# EAGLE design TiltMouseThroughHole (EAGLE 6.5.0)
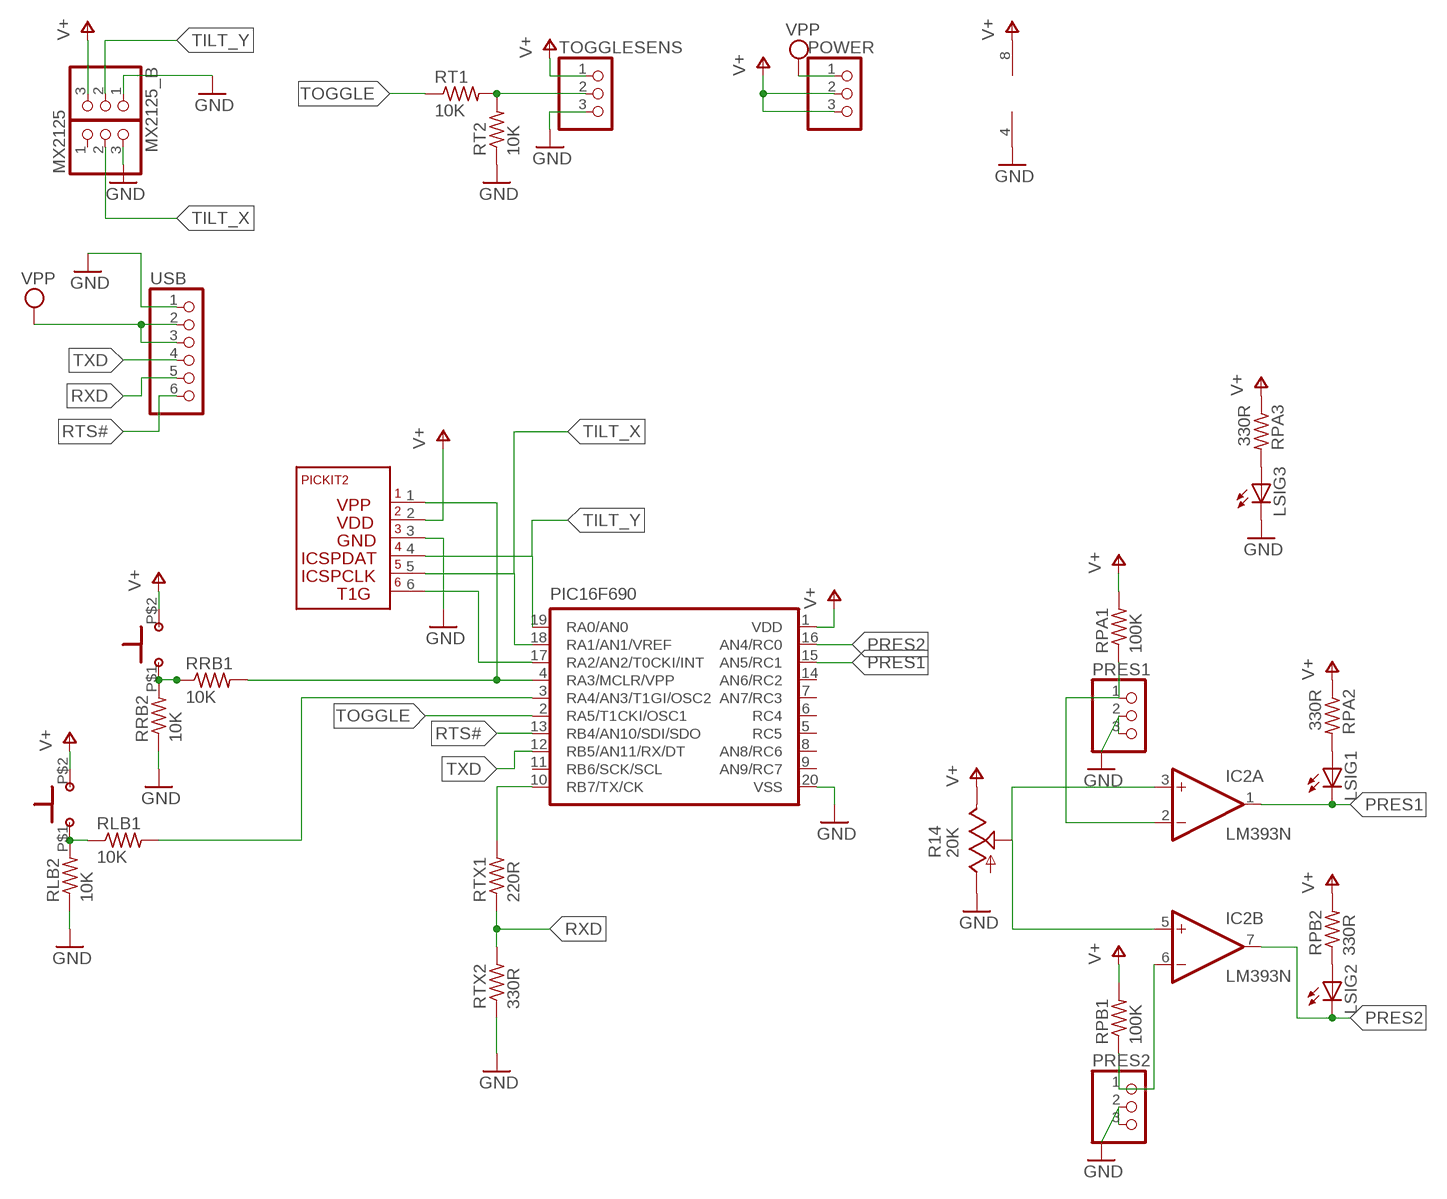
[diagram p0: schematic, sheet 1]

## Parts
IC2  LM393N  [DIL08]
LB  PUSHBUTTON  [PUSHBUTTON]
LSIG1  LED5MM  [LED5MM]
LSIG2  LED5MM  [LED5MM]
LSIG3  LED5MM  [LED5MM]
MX2125  PINHD-1X3  [1X03]
MX2125_B  PINHD-1X3  [1X03]
PIC16F690  PIC16F6XX  [DIL20]
POWER  PINHD-1X3  [1X03]
PRES1  PINHD-1X3/90  [1X03/90]
PRES2  PINHD-1X3/90  [1X03/90]
R14  20K  TRIM_US-B25P  [B25P]
RB  PUSHBUTTON  [PUSHBUTTON]
RLB1  10K  R-US_0207/12  [0207/12]
RLB2  10K  R-US_0207/12  [0207/12]
RPA1  100K  R-US_0207/10  [0207/10]
RPA2  330R  R-US_0207/15  [0207/15]
RPA3  330R  R-US_0207/10  [0207/10]
RPB1  100K  R-US_0207/10  [0207/10]
RPB2  330R  R-US_0207/15  [0207/15]
RRB1  10K  R-US_0207/12  [0207/12]
RRB2  10K  R-US_0207/12  [0207/12]
RT1  10K  R-US_0207/10  [0207/10]
RT2  10K  R-US_0207/10  [0207/10]
RTX1  220R  R-US_0207/15  [0207/15]
RTX2  330R  R-US_0207/15  [0207/15]
TOGGLESENS  PINHD-1X3  [1X03]
U$1  PICKIT-ICSP  [PICKITJUMPER]
USB  PINHD-1X6/90  [1X06/90]

## Nets
GND: IC2.4(P:V-) LSIG3.K(C) MX2125.3 MX2125_B.1 PIC16F690.20(VSS) PRES1.2 PRES1.3 PRES2.2 PRES2.3 R14.A RLB2.1 RRB2.1 RT2.1 RTX2.1 TOGGLESENS.3 U$1.3 USB.1
N$1: PIC16F690.4(RA3/MCLR/VPP) RRB1.2 U$1.1
N$2: RT1.2 RT2.2 TOGGLESENS.2
N$3: IC2.2(A:-IN) PRES1.1 RPA1.1
N$4: PIC16F690.17(RA2/AN2/T0CKI/INT) U$1.6
N$5: PIC16F690.10(RB7/TX/CK) RTX1.2
N$6: RB.P$1 RRB1.1 RRB2.2
N$7: LB.P$1 RLB1.1 RLB2.2
N$8: PIC16F690.3(RA4/AN3/T1GI/OSC2) RLB1.2
N$9: IC2.6(B:-IN) PRES2.1 RPB1.1
N$10: IC2.3(A:+IN) IC2.5(B:+IN) R14.S
N$11: LSIG2.A RPB2.1
N$12: LSIG1.A RPA2.2
N$13: LSIG3.A RPA3.2
PRES1: IC2.1(A:OUT) LSIG1.K(C) PIC16F690.15(AN5/RC1)
PRES2: IC2.7(B:OUT) LSIG2.K(C) PIC16F690.16(AN4/RC0)
RTS#: PIC16F690.13(RB4/AN10/SDI/SDO) USB.6
RXD: RTX1.1 RTX2.2 USB.5
TILT_X: MX2125.2 PIC16F690.18(RA1/AN1/VREF) U$1.5
TILT_Y: MX2125_B.2 PIC16F690.19(RA0/AN0) U$1.4
TOGGLE: PIC16F690.2(RA5/T1CKI/OSC1) RT1.1
TXD: PIC16F690.12(RB5/AN11/RX/DT) USB.4
V+: IC2.8(P:V+) LB.P$2 MX2125_B.3 PIC16F690.1(VDD) POWER.2 POWER.3 R14.E RB.P$2 RPA1.2 RPA2.1 RPA3.1 RPB1.2 RPB2.2 TOGGLESENS.1 U$1.2
VPP: POWER.1 USB.2 USB.3
Unconnected: MX2125.1 PIC16F690.5(RC5) PIC16F690.6(RC4) PIC16F690.7(AN7/RC3) PIC16F690.8(AN8/RC6) PIC16F690.9(AN9/RC7) PIC16F690.11(RB6/SCK/SCL) PIC16F690.14(AN6/RC2)

## Library data of the parts
IC2 = linear:LM393: COMPARATOR
LB RB = TEJ4M1:PUSHBUTTON
LSIG1-LSIG3 = led:LED: LED OSRAM: - CHIPLED LG R971, LG N971, LY N971, LG Q971, LY Q971, LO R971, LY R971 LH N974, LH R974 LS Q976, LO Q976, LY Q976 LO Q996 - Hyper CHIPLED LW Q18S LB Q993, LB Q99A, LB R99A - SideLED LS A670, LO A670, LY A670, LG A670, LP A670 LB A673, LV A673, LT A673, LW A673 LH A674 LY A675 LS A676, LA A676, LO A676, LY A676, LW A676 LS A679, LY A679, LG A679 - Hyper Micro SIDELED® LS Y876, LA Y876, LO Y876, LY Y876 LT Y87S - SmartLED LW L88C, LW L88S LB L89C, LB L89S, LG L890 LS L89K, LO L89K, LY L89K LS L896, LA L896, LO L896, LY L896 - TOPLED LS T670, LO T670, LY T670, LG T670, LP T670 LSG T670, LSP T670, LSY T670, LOP T670, LYG T670 LG T671, LOG T671, LSG T671 LB T673, LV T673, LT T673, LW T673 LH T674 LS T676, LA T676, LO T676, LY T676, LB T676, LH T676, LSB T676, LW T676 LB T67C, LV T67C, LT T67C, LS T67K, LO T67K, LY T67K, LW E67C LS E67B, LA E67B, LO E67B, LY E67B, LB E67C, LV E67C, LT E67C LW T67C LS T679, LY T679, LG T679 LS T770, LO T770, LY T770, LG T770, LP T770 LB T773, LV T773, LT T773, LW T773 LH T774 LS E675, LA E675, LY E675, LS T675 LS T776, LA T776, LO T776, LY T776, LB T776 LHGB T686 LT T68C, LB T68C - Hyper Mini TOPLED® LB M676 - Mini TOPLED Santana® LG M470 LS M47K, LO M47K, LY M47K Source: http://www.osram.convergy.de LUXEON: - LUMILED® LXK2-PW12-R00, LXK2-PW12-S00, LXK2-PW14-U00, LXK2-PW14-V00 LXK2-PM12-R00, LXK2-PM12-S00, LXK2-PM14-U00 LXK2-PE12-Q00, LXK2-PE12-R00, LXK2-PE12-S00, LXK2-PE14-T00, LXK2-PE14-U00 LXK2-PB12-K00, LXK2-PB12-L00, LXK2-PB12-M00, LXK2-PB14-N00, LXK2-PB14-P00, LXK2-PB14-Q00 LXK2-PR12-L00, LXK2-PR12-M00, LXK2-PR14-Q00, LXK2-PR14-R00 LXK2-PD12-Q00, LXK2-PD12-R00, LXK2-PD12-S00 LXK2-PH12-R00, LXK2-PH12-S00 LXK2-PL12-P00, LXK2-PL12-Q00, LXK2-PL12-R00 Source: www.luxeon.com KINGBRIGHT: KA-3528ASYC Source: www.kingbright.com
MX2125 MX2125_B POWER PRES1 PRES2 TOGGLESENS = pinhead:PINHD-1X3: PIN HEADER
PIC16F690 = pic16f690:PIC16F6XX
R14 = pot:TRIM_US-: POTENTIOMETER
RLB1 RLB2 RPA1-RPA3 RPB1 RPB2 RRB1 RRB2 RT1 RT2 RTX1 RTX2 = resistor:R-US_: RESISTOR, American symbol
U$1 = TEJ4M1:PICKIT-ICSP: The Jumper for connecting in a PICKIT 2
USB = pinhead:PINHD-1X6: PIN HEADER

## Board
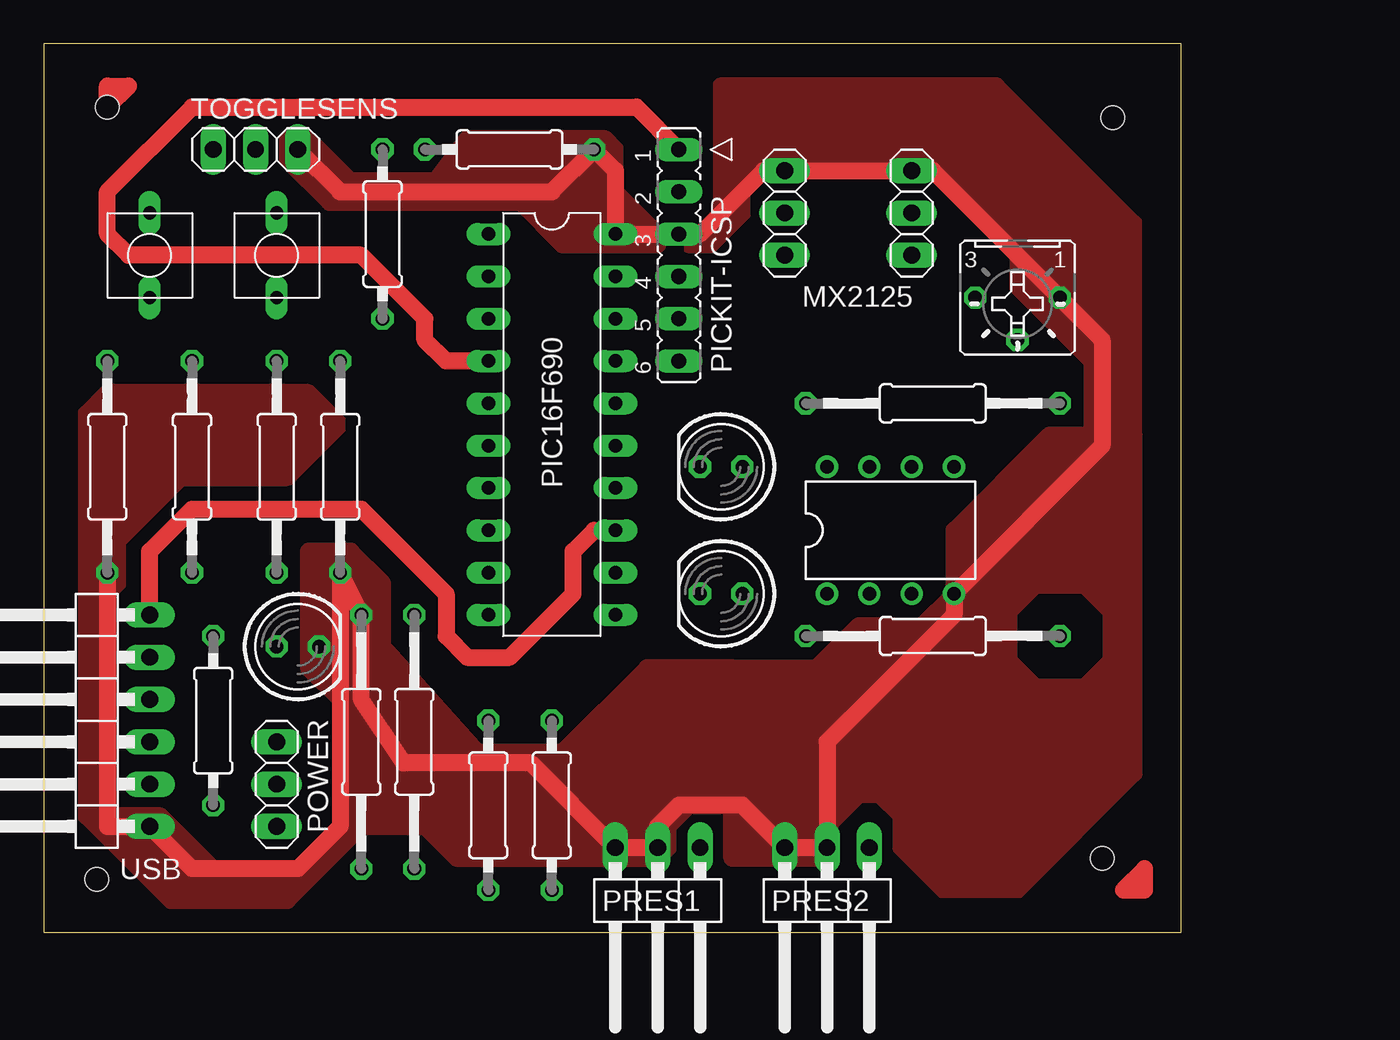
[diagram p1: board, top side]
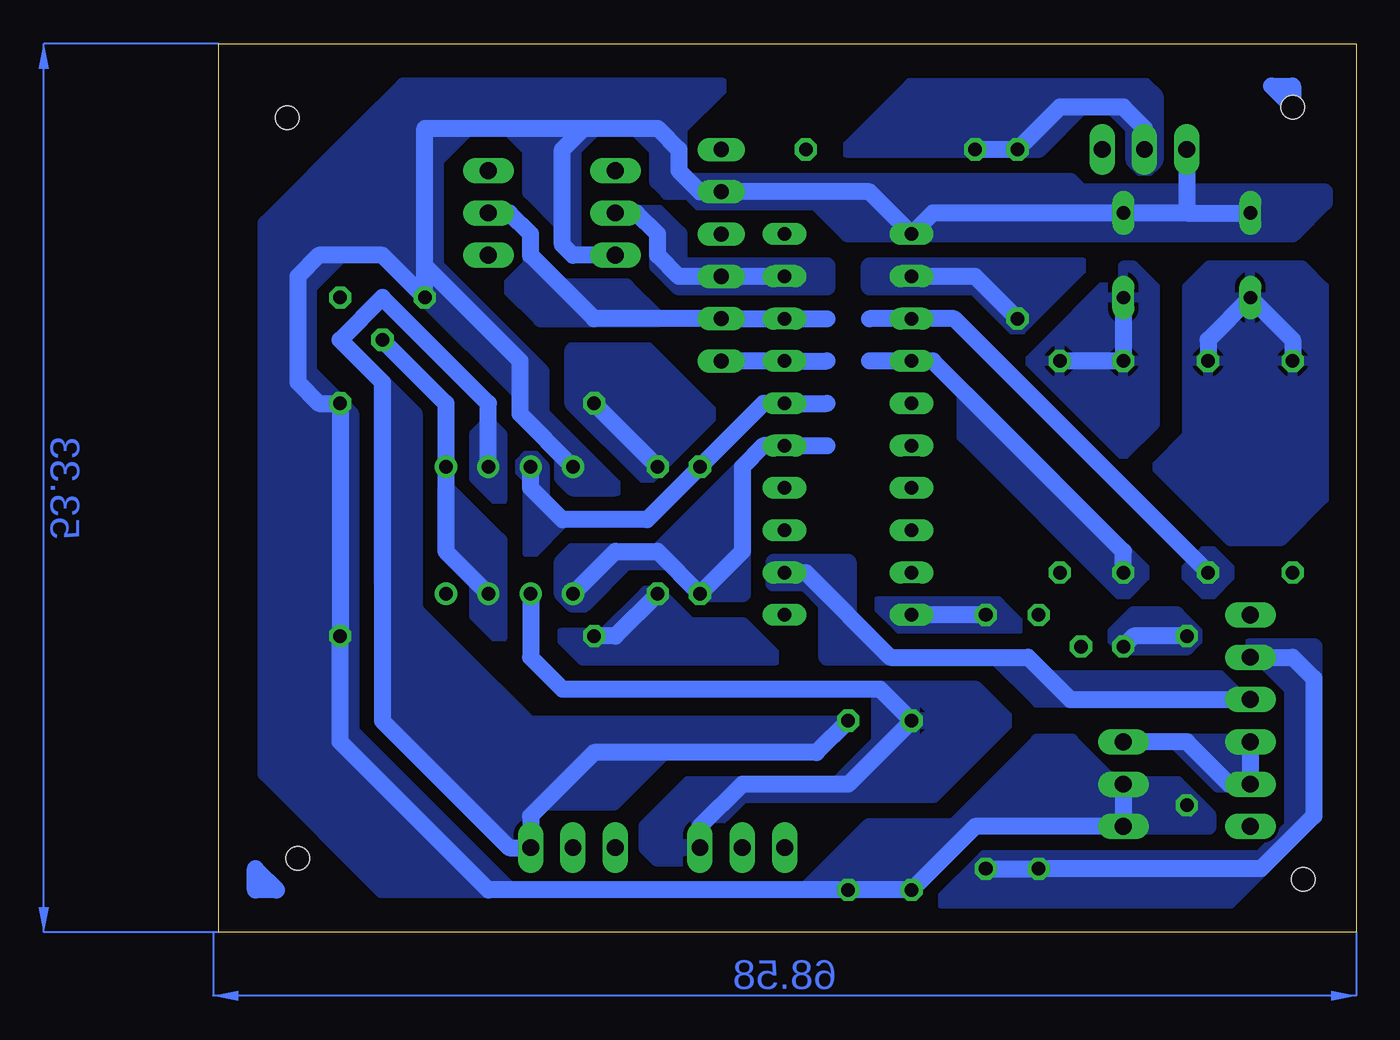
[diagram p2: board, bottom side, seen from below]

Size 68.25 x 53.33 mm. Coordinates in mm from the lower left corner, seen from the top.
Outline: 0,0 68.25,0 68.25,53.33 0,53.33 0,0
Copper layers (1*16): Top 0.035mm / dielectric 1.5mm / Bottom 0.035mm
Design rules "default *": minimum track width 40mil, minimum drill 24mil, track to track 8mil, track to pad 8mil, pad to pad 8mil, via to via 8mil, smd to smd 8mil, copper to edge 40mil, drill to drill 8mil, minimum pad ring 10mil, minimum via ring 8mil, stop-mask expansion 4mil, vias tented up to drill 0mil, thermal gap 10mil
Holes 1.4 mm at 63.5,4.45 64.14,48.9 3.81,49.53 3.17,3.17

### Footprints (pad centres in the part's own frame; a part is rotated, then mirrored left to right if it is on the bottom)
DIL08 = drill 0.813 pad 1.27: 1 -3.81,-3.81; 2 -1.27,-3.81; 3 1.27,-3.81; 4 3.81,-3.81; 5 3.81,3.81; 6 1.27,3.81; 7 -1.27,3.81; 8 -3.81,3.81
PUSHBUTTON = drill 0.8 long: P$1 -2.54,0; P$2 2.54,0
LED5MM = drill 0.813 octagon: A -1.27,0; K 1.27,0
1X03 = drill 1.016 long: 1 -2.54,0; 2 0,0; 3 2.54,0
DIL20 = drill 0.813 long: 1 -11.43,-3.81; 2 -8.89,-3.81; 3 -6.35,-3.81; 4 -3.81,-3.81; 5 -1.27,-3.81; 6 1.27,-3.81; 7 3.81,-3.81; 8 6.35,-3.81; 9 8.89,-3.81; 10 11.43,-3.81; 11 11.43,3.81; 12 8.89,3.81; 13 6.35,3.81; 14 3.81,3.81; 15 1.27,3.81; 16 -1.27,3.81; 17 -3.81,3.81; 18 -6.35,3.81; 19 -8.89,3.81; 20 -11.43,3.81
1X03/90 = drill 1.016 long: 1 -2.54,-3.81; 2 0,-3.81; 3 2.54,-3.81
B25P = drill 0.813 octagon: A -2.54,0; E 2.54,0; S 0,2.54
0207/12 = drill 0.813 octagon: 1 -6.35,0; 2 6.35,0
0207/10 = drill 0.813 octagon: 1 -5.08,0; 2 5.08,0
0207/15 = drill 0.813 octagon: 1 -7.62,0; 2 7.62,0
PICKITJUMPER = drill 0.914 long: 1 6.35,3.81; 2 3.81,3.81; 3 1.27,3.81; 4 -1.27,3.81; 5 -3.81,3.81; 6 -6.35,3.81
1X06/90 = drill 1.016 long: 1 -6.35,-3.81; 2 -3.81,-3.81; 3 -1.27,-3.81; 4 1.27,-3.81; 5 3.81,-3.81; 6 6.35,-3.81

### Placement (x,y rotation side)
IC2  50.8,24.13 0 top
LB  6.35,40.64 90 top
LSIG1  40.64,20.32 180 top
LSIG2  40.64,27.94 180 top
LSIG3  15.24,17.14 0 top
MX2125  52.07,43.18 90 top
MX2125_B  44.45,43.18 270 top
PIC16F690  30.48,30.48 270 top
POWER  13.97,8.89 270 top
PRES1  36.83,1.27 180 top
PRES2  46.99,1.27 180 top
R14  58.42,38.1 180 top
RB  13.97,40.64 90 top
RLB1  8.89,27.94 270 top
RLB2  3.81,27.94 90 top
RPA1  26.67,7.62 270 top
RPA2  53.34,17.78 180 top
RPA3  10.16,12.7 90 top
RPB1  30.48,7.62 270 top
RPB2  53.34,31.75 0 top
RRB1  13.97,27.94 270 top
RRB2  17.78,27.94 90 top
RT1  20.32,41.91 90 top
RT2  27.94,46.99 180 top
RTX1  22.23,11.43 90 top
RTX2  19.05,11.43 270 top
TOGGLESENS  12.7,46.99 0 top
U$1  41.91,40.64 90 top
USB  2.54,12.7 90 top

### Tracks (layer width: path | path; a pad name or v marks a point on that pad's centre or on a via)
GND
  Top 1.016: RLB2.1 3.81,6.35 USB.1 8.89,3.81 15.24,3.81 17.78,6.35 RRB2.1 RTX2.1 19.05,13.97 21.59,10.16 29.21,10.16 PRES1.3 PRES1.2 36.83,6.35 38.1,7.62 41.91,7.62 PRES2.3 PRES2.2 46.99,11.43 54.61,19.05 IC2.4 63.5,29.21 63.5,35.56 R14.A 53.34,45.72 MX2125.3 MX2125_B.1 43.18,45.72 39.37,41.91 U$1.3 PIC16F690.20 34.29,45.72 RT2.1 30.48,44.45 17.78,44.45 TOGGLESENS.3
  pour Top (no thermals): 36.83,41.91 34.29,44.45 34.29,46.99 33.66,47.62 25.4,47.62 23.5,45.09 18.41,45.09 15.88,47.62 14.61,47.62 14.61,46.35 17.14,43.81 28.57,43.81 31.11,41.27 36.83,41.27
  pour Top (no thermals): 38.73,41.27 40.01,41.27 41.91,43.18 41.91,44.45 43.18,45.72 53.34,45.72 58.42,40.64 58.42,38.73 62.87,34.29 62.87,29.21 65.41,29.21 65.41,42.55 57.15,50.8 40.64,50.8 40.64,43.18
  pour Top (no thermals): 65.41,29.84 65.41,9.53 58.42,2.54 53.98,2.54 51.44,5.08 51.44,6.99 50.16,8.26 48.9,8.26 46.99,6.35 46.99,4.45 41.27,4.45 41.27,15.88 46.35,15.88 48.9,18.41 52.7,18.41 54.61,20.32 54.61,24.13 60.33,29.84
  pour Top (no thermals): 41.27,15.88 36.2,15.88 31.11,10.79 26.04,10.79 20.32,17.14 20.32,20.95 18.41,22.86 15.88,22.86 15.88,15.88 17.78,13.97 17.78,6.35 15.24,3.81 10.16,3.81 6.99,6.99 2.54,6.99 7.62,1.91 14.61,1.91 19.05,6.35 22.86,6.35 24.77,4.45 36.83,4.45 37.47,5.08 37.47,6.35 38.73,7.62 41.27,7.62
  pour Top (no thermals): 3.81,20.32 4.45,20.95 4.45,23.5 8.26,27.3 14.61,27.3 17.78,30.48 15.88,32.38 3.81,32.38 2.54,31.11 2.54,6.99 3.81,6.99
  cutout Top: 59.69,20.32 58.42,19.05 58.42,16.51 59.69,15.24 62.23,15.24 63.5,16.51 63.5,19.05 62.23,20.32
N$1
  Top 1.016: PIC16F690.4 24.13,34.29 22.86,35.56 22.86,36.83 19.05,40.64 5.08,40.64 3.81,41.91 3.81,44.45 8.89,49.53 35.56,49.53 U$1.1
  Bottom 1.016: RRB1.2 13.97,22.86 25.4,34.29 PIC16F690.4 29.21,34.29
  pour Bottom (no thermals): 23.5,32.38 23.5,29.84 13.97,20.32 12.7,21.59
N$2
  Bottom 1.016: TOGGLESENS.2 12.7,48.26 13.97,49.53 17.78,49.53 RT1.2 RT2.2
  pour Bottom (no thermals): 30.48,46.99 26.67,50.8 12.7,50.8 12.06,50.16 12.06,46.35 12.7,45.72 13.34,46.35 13.34,48.26 14.61,49.53 16.51,49.53 19.05,46.99
N$3
  Bottom 1.016: PRES1.1 39.37,6.35 36.83,8.89 30.48,8.89 RPA1.1 28.57,14.61 47.62,14.61 49.53,16.51 IC2.2
  pour Bottom: 28.57,14.61 22.86,14.61 20.95,12.7 25.4,8.26 36.83,8.26 39.37,5.71 39.37,4.45 41.91,4.45 42.55,5.08 42.55,6.35 40.01,8.89 31.11,8.89 28.57,11.43
N$4
  Bottom 1.016: U$1.6 PIC16F690.17 31.75,34.29
N$5
  Bottom 1.016: RTX1.2 PIC16F690.10
  pour Bottom (no thermals): 20.32,18.41 27.3,18.41 28.57,19.68 21.59,19.68
N$6
  Bottom 1.016: RB.P$1 RRB1.1 RRB2.2
  pour Bottom: 13.34,40.01 13.97,40.01 19.68,34.29 13.97,28.57 12.06,30.48 12.06,38.73
N$7
  Bottom 1.016: RLB1.1 8.89,35.56 LB.P$1 3.81,35.56 RLB2.2
  pour Bottom: 3.17,40.01 8.89,40.01 10.16,38.73 10.16,29.84 12.06,27.94 7.62,23.5 4.45,23.5 1.91,26.04 1.91,38.73
N$8
  Bottom 1.016: RLB1.2 24.13,36.83 PIC16F690.3 29.21,36.83
  pour Bottom (no thermals): 8.89,22.86 10.16,21.59 8.89,20.32 7.62,21.59
N$9
  Bottom 1.016: RPB1.1 32.38,10.79 45.72,10.79 49.53,6.99 PRES2.1 50.8,5.08 58.42,12.7 58.42,33.02 60.96,35.56 58.42,38.1 52.07,31.75 IC2.6
  pour Bottom: 30.48,12.7 49.53,12.7 58.42,21.59 58.42,12.7 50.8,5.08 49.53,5.08 49.53,6.99 48.9,7.62 44.45,7.62 41.27,10.79 32.38,10.79
  pour Bottom (no thermals): 58.42,33.02 56.52,31.11 56.52,19.05 58.42,20.95
  pour Bottom (no thermals): 52.07,30.48 51.44,29.84 51.44,26.04 52.7,27.3 52.7,29.84
N$10
  Bottom 1.016: R14.S 54.61,31.75 IC2.5 54.61,22.86 IC2.3
  pour Bottom (no thermals): 54.61,26.67 51.44,23.5 51.44,17.78 52.7,19.05 52.7,20.95 54.61,22.86
N$11
  Bottom 1.016: RPB2.1 LSIG2.A
  pour Bottom (no thermals): 38.73,31.11 42.55,27.3 46.99,31.75 46.99,34.92 42.55,34.92
N$12
  Bottom 1.016: LSIG1.A 44.45,17.78 RPA2.2
  pour Bottom (no thermals): 47.62,17.78 45.09,17.78 42.55,20.32 41.91,20.32 40.01,18.41 36.83,18.41 34.92,16.51 46.35,16.51
N$13
  Bottom 1.016: RPA3.2 13.34,17.78 LSIG3.A
  pour Bottom (no thermals): 13.97,17.14 10.16,17.14 9.53,17.78 10.79,19.05 13.34,19.05 14.61,17.78
N$15
  Top 1.016: 3.81,49.53 3.81,50.8 5.08,50.8 3.81,49.53
N$16
  Top 1.016: 66.04,3.81 64.77,2.54 66.04,2.54 66.04,3.81
N$17
  Bottom 1.016: 3.81,50.8 3.81,49.53 5.08,50.8 3.81,50.8
N$18
  Bottom 1.016: 66.04,3.81 64.77,2.54 66.04,2.54 66.04,3.81
PRES1
  Bottom 1.016: IC2.1 44.45,22.86 41.91,22.86 LSIG1.K 36.83,22.86 36.83,27.94 35.56,29.21 PIC16F690.15 31.75,29.21
  pour Bottom (no thermals): 41.27,22.23 43.81,22.23 46.35,19.68 46.99,19.68 47.62,20.32 47.62,22.23 46.99,22.86 41.91,22.86 36.83,27.94 36.83,20.32 39.37,20.32
PRES2
  Bottom 1.016: IC2.7 49.53,26.67 47.62,24.77 42.55,24.77 LSIG2.K 35.56,31.75 PIC16F690.16 31.75,31.75
  pour Bottom (no thermals): 49.53,26.67 49.53,22.86 47.62,24.77
  pour Bottom (no thermals): 49.53,27.3 50.16,27.94 49.53,28.57 48.9,27.94 48.9,26.04 49.53,26.67
RTS#
  Top 1.016: USB.6 6.35,22.86 8.89,25.4 19.05,25.4 24.13,20.32 24.13,17.78 25.4,16.51 27.94,16.51 31.75,20.32 31.75,22.86 33.02,24.13 PIC16F690.13
RXD
  Bottom 1.016: RTX1.1 RTX2.2 5.71,3.81 2.54,6.99 2.54,15.24 3.81,16.51 USB.5
  pour Bottom (no thermals): 24.77,1.91 22.23,4.45 5.71,4.45 3.81,6.35 3.81,14.61 6.35,17.14 2.54,17.14 2.54,6.99 7.62,1.91
TILT_X
  Bottom 1.016: MX2125.2 50.8,43.18 49.53,41.91 49.53,40.64 45.72,36.83 U$1.5 PIC16F690.18 31.75,36.83
  pour Bottom: 48.9,36.83 41.91,36.83 43.81,38.73 47.62,38.73 49.53,40.64 49.53,40.01 50.8,38.73
TILT_Y
  Bottom 1.016: PIC16F690.19 U$1.4 40.64,39.37 41.91,40.64 41.91,41.91 43.18,43.18 MX2125_B.2
  pour Bottom (no thermals): 43.18,43.18 41.91,43.18 40.64,41.91 40.64,40.01 31.75,40.01 31.75,38.73 40.64,38.73 41.91,40.01 41.91,41.91
TOGGLE
  Bottom 1.016: RT1.1 22.86,39.37 PIC16F690.2
  pour Bottom (no thermals): 29.21,38.73 29.21,40.01 16.51,40.01 20.32,36.2 22.86,38.73
TXD
  Bottom 1.016: PIC16F690.12 33.02,21.59 27.94,16.51 19.68,16.51 17.14,13.97 USB.4
  pour Bottom (no thermals): 6.99,13.97 19.05,13.97 21.59,16.51 19.68,16.51 18.41,15.24 8.26,15.24
  pour Bottom (no thermals): 27.94,16.51 31.75,16.51 31.75,19.68 33.02,20.95 34.92,20.95 34.92,22.23 30.48,22.23 30.48,19.05
V+
  Bottom 1.016: POWER.2 POWER.3 22.86,6.35 RPA1.2 RPB1.2 52.07,2.54 60.96,11.43 RPA2.1 RPB2.2 62.23,31.75 63.5,33.02 63.5,39.37 62.23,40.64 58.42,40.64 R14.E 55.88,40.01 | 10.16,43.18 LB.P$2 | TOGGLESENS.1 10.16,43.18 | 10.16,43.18 RB.P$2 25.4,43.18 PIC16F690.1 29.21,44.45 U$1.2 39.37,44.45 40.64,45.72 40.64,46.99 41.91,48.26 46.35,48.26 | MX2125_B.3 46.99,40.64 47.62,41.27 47.62,46.99 46.35,48.26 | 55.88,40.01 55.88,48.26 46.35,48.26 | IC2.8 50.16,31.11 50.16,34.29 55.88,40.01
  pour Bottom (no thermals): 33.02,2.54 29.21,6.35 24.13,6.35 19.05,11.43 17.14,11.43 14.61,8.89 10.79,8.89 8.89,6.99 8.89,6.35 22.86,6.35 26.67,2.54
  pour Bottom (no thermals): 50.8,2.54 58.42,2.54 65.41,9.53 65.41,42.55 59.69,48.26 55.88,48.26 55.88,38.1 58.42,40.64 60.96,40.64 62.87,38.73 62.87,33.66 60.33,31.11 60.33,12.06
  pour Bottom (no thermals): 55.88,38.1 50.16,32.38 50.16,31.11 47.62,28.57 47.62,27.3 46.99,26.67 44.45,26.67 48.9,31.11 48.9,33.66 55.88,40.64
  pour Bottom (no thermals): 53.34,48.26 55.24,46.35 55.24,40.01 55.88,40.64 55.88,48.26
  pour Bottom: 47.62,42.55 49.53,44.45 49.53,46.99 50.8,48.26 45.72,48.26 46.99,46.99 46.99,40.64 47.62,41.27
  pour Bottom: 39.37,44.45 41.27,44.45 41.91,45.09 41.91,46.99 43.18,48.26 40.64,48.26 40.64,45.72
  pour Bottom (no thermals): 3.81,41.91 30.48,41.91 32.38,43.81 39.37,43.81 40.64,45.09 17.14,45.09 16.51,44.45 1.91,44.45 1.91,43.81
  pour Bottom: 40.64,48.26 38.1,50.8 57.15,50.8 59.69,48.26
VPP
  Bottom 1.016: USB.3 USB.2 7.62,8.89 10.16,11.43 POWER.1
  pour Bottom (no thermals): 10.79,11.43 6.35,11.43 6.35,8.89 8.26,8.89
(copper drawn outside any net)
  shapes: Bottom area x2

### Text on the board
tStop: Jonathan P.
bStop: Jonathan P.